# Altium schematic sheet Measure.SchDoc
size A3; SheetNumber: 4; SheetTotal: 5
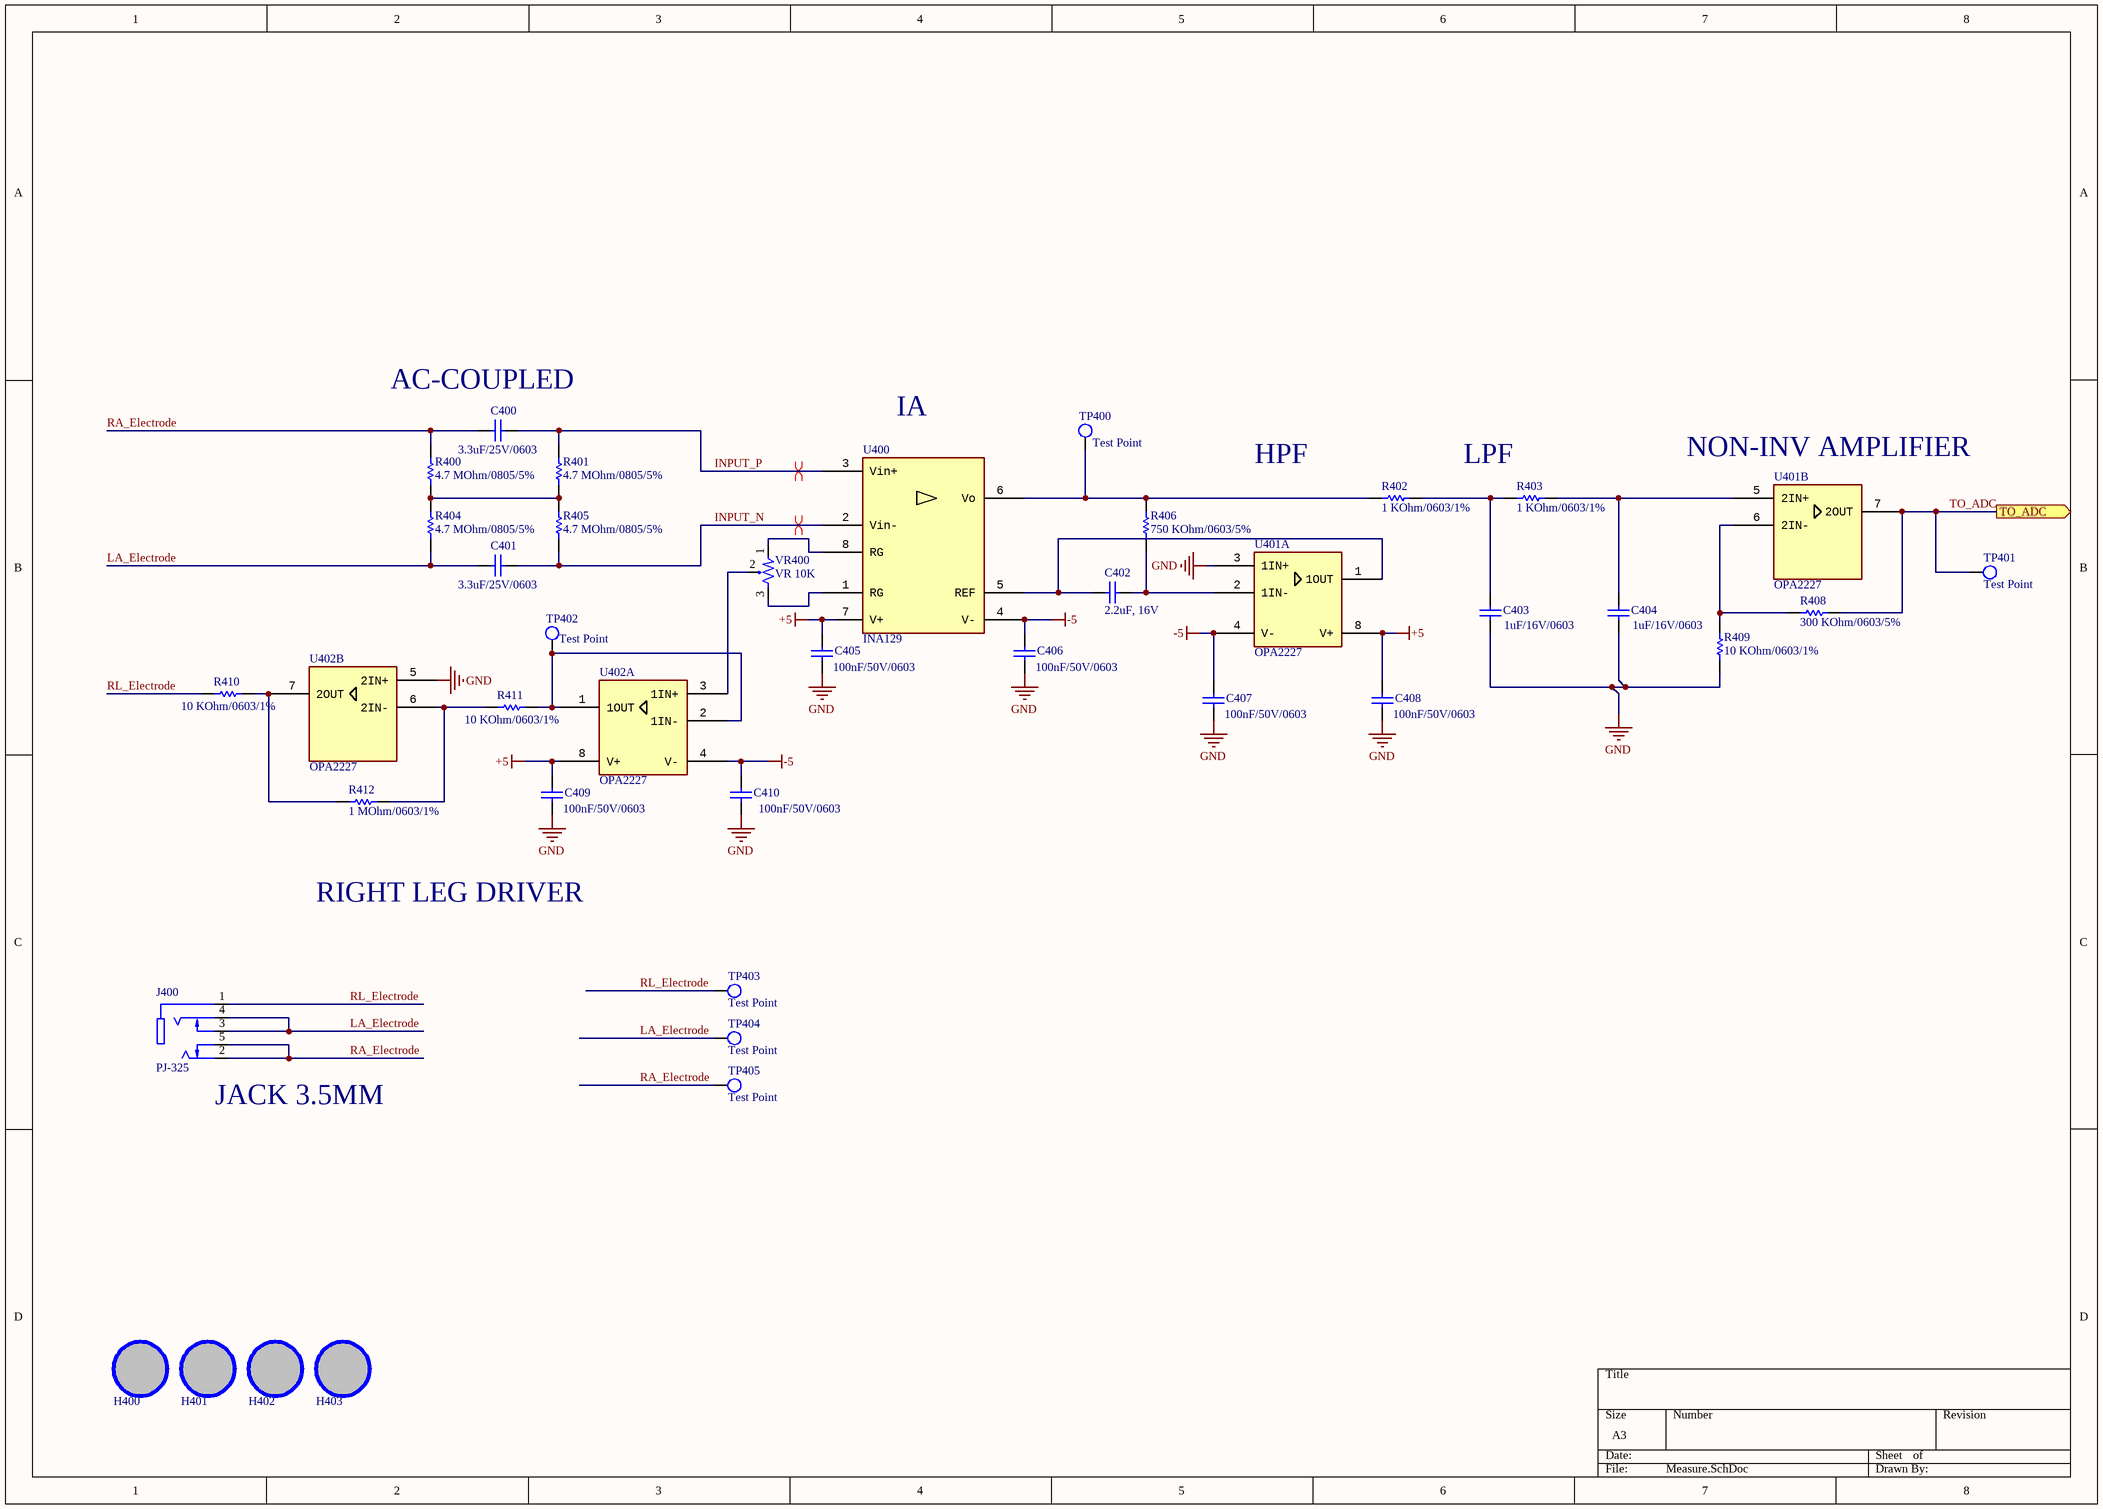
[diagram p0: Measure.SchDoc]

## Parts
C400  value 3.3uF/25V/0603  [WCAP-CSGP_0805_H=1.25mm]  (hidden comment: 3.3uF, 25V)
C401  value 3.3uF/25V/0603  [WCAP-CSGP_0805_H=1.25mm]  (hidden comment: 3.3uF, 25V)
C402  2.2uF, 16V  [WCAP-CSGP_0603_H=0.8mm_Reflow]
C403  value 1uF/16V/0603  [WCAP-CSGP_0603_H=0.8mm_Reflow]  (hidden comment: 1uF, 16V)
C404  value 1uF/16V/0603  [WCAP-CSGP_0603_H=0.8mm_Reflow]  (hidden comment: 1uF, 16V)
C405  value 100nF/50V/0603  [WCAP-CSGP_0603_H=0.8mm_Reflow]  (hidden comment: 100nF, 25V)
C406  value 100nF/50V/0603  [WCAP-CSGP_0603_H=0.8mm_Reflow]  (hidden comment: 100nF, 25V)
C407  value 100nF/50V/0603  [WCAP-CSGP_0603_H=0.8mm_Reflow]  (hidden comment: 100nF, 25V)
C408  value 100nF/50V/0603  [WCAP-CSGP_0603_H=0.8mm_Reflow]  (hidden comment: 100nF, 25V)
C409  value 100nF/50V/0603  [WCAP-CSGP_0603_H=0.8mm_Reflow]  (hidden comment: 100nF, 25V)
C410  value 100nF/50V/0603  [WCAP-CSGP_0603_H=0.8mm_Reflow]  (hidden comment: 100nF, 25V)
H400  Hole  [LO KHOAN 3MM]  (value not drawn)
H401  Hole  [LO KHOAN 3MM]  (value not drawn)
H402  Hole  [LO KHOAN 3MM]  (value not drawn)
H403  Hole  [LO KHOAN 3MM]  (value not drawn)
J400  value PJ-325  [3.5 mm, Strereo]  (hidden comment: PJ-324)
R400  value 4.7 MOhm/0805/5%  [R0805]  (hidden comment: Resistor 4.7 MOhm 0805 5%)
R401  value 4.7 MOhm/0805/5%  [R0805]  (hidden comment: Resistor 4.7 MOhm 0805 5%)
R402  value 1 KOhm/0603/1%  [R0603]  (hidden comment: Resistor 1 KOhm 0603 1%)
R403  value 1 KOhm/0603/1%  [R0603]  (hidden comment: Resistor 1 KOhm 0603 1%)
R404  value 4.7 MOhm/0805/5%  [R0805]  (hidden comment: Resistor 4.7 MOhm 0805 5%)
R405  value 4.7 MOhm/0805/5%  [R0805]  (hidden comment: Resistor 4.7 MOhm 0805 5%)
R406  value 750 KOhm/0603/5%  [R0603]  (hidden comment: Resistor 750 KOhm 0603 5%)
R408  value 300 KOhm/0603/5%  [R0603]  (hidden comment: Resistor 300 KOhm 0603 5%)
R409  value 10 KOhm/0603/1%  [R0603]  (hidden comment: Resistor 10 KOhm 0603 1%)
R410  value 10 KOhm/0603/1%  [R0603]  (hidden comment: Resistor 10 KOhm 0603 1%)
R411  value 10 KOhm/0603/1%  [R0603]  (hidden comment: Resistor 10 KOhm 0603 1%)
R412  value 1 MOhm/0603/1%  [R0603]  (hidden comment: Resistor 1 MOhm 0603 1%)
TP400  Test Point  [TP]
TP401  Test Point  [TP]
TP402  Test Point  [TP]
TP403  Test Point  [TP]
TP404  Test Point  [TP]
TP405  Test Point  [TP]
U400  INA129  [SOIC-8]
U401  OPA2227  [SOIC-8]  (parts A,B of 2)
U402  OPA2227  [SOIC-8]  (parts A,B of 2)
VR400  value VR 10K  [VARISTOR 2]  (hidden comment: 10K)

## Ports
TO_ADC (out)

## Nets
+5: C405.2 C408.1 C409.2 U400.7(V+) U401.8(V+) U402.8(V+)
-5: C406.1 C407.2 C410.1 U400.4(V-) U401.4(V-) U402.4(V-)
GND: C403.1 C404.1 C405.1 C406.2 C407.1 C408.2 C409.1 C410.2 R409.1 U401.3(1IN+) U402.5(2IN+)
INPUT_N: C401.2 R405.1 U400.2(Vin-)
INPUT_P: C400.2 R401.2 U400.3(Vin+)
LA_Electrode: C401.1 J400.3 J400.4 R404.1 TP404.TP1
RA_Electrode: C400.1 J400.2 J400.5 R400.2 TP405.TP1
RL_Electrode: J400.1 R410.1 TP403.TP1
TO_ADC: R408.2 TP401.TP1 U401.7(2OUT) ; port TO_ADC
NetC402_1: C402.1 R406.1 U401.2(1IN-)
NetC402_2: C402.2 U400.5(REF) U401.1(1OUT)
NetC403_2: C403.2 R402.2 R403.1
NetC404_2: C404.2 R403.2 U401.5(2IN+)
NetR400_1: R400.1 R401.1 R404.2 R405.2
NetR402_1: R402.1 R406.2 TP400.TP1 U400.6(Vo)
NetR408_1: R408.1 R409.2 U401.6(2IN-)
NetR410_2: R410.2 R412.1 U402.7(2OUT)
NetR411_1: R411.1 R412.2 U402.6(2IN-)
NetR411_2: R411.2 TP402.TP1 U402.1(1OUT) U402.2(1IN-)
NetU400_1: U400.1(RG) VR400.3
NetU400_8: U400.8(RG) VR400.1
NetU402_3: U402.3(1IN+) VR400.2

Not connected (* = marked no-connect by the designer): H400 1; H401 1; H402 1; H403 1

## Layout directives
differential pair: INPUT_N, INPUT_P

## Notes on the sheet
- (near C400) AC-COUPLED
- (near U400) IA
- HPF
- (near R403) LPF
- (near U401) NON-INV AMPLIFIER
- RIGHT LEG DRIVER
- (near J400) JACK 3.5MM

## Library data of the parts
C400 C401 = 885012107017: WCAP-CSGP Multilayer Ceramic Chip Capacitor, General Purpose, size 0805, X5R, 3.3uF, 25V; Manufacturer: Wurth Elektronik; Rated Voltage: 25VDC; Isolation Resistance: >=0.03GOhm; Capacitance Tolerance: +/-20%; Technical Reference: X5R0805335M025DFCT10000; ComponentLink1Description: Manufacturer; ComponentLink1URL: http://www.we-online.de; ComponentLink2Description: Datasheet; ComponentLink2URL: https://www.we-online.com/catalog/datasheet/885012107017.pdf; Operating Temperature: -55 to +85degC; Packaging: Tape and Reel; Manufacturer Part Number: 885012107017; Published Date: May 2020; Ceramic Type: X5R; Dissipation Factor: =<10%; Height: 1.25mm; Mounting Technology: SMT; Size: 0805
C402 = 885012106018: WCAP-CSGP Multilayer Ceramic Chip Capacitor, General Purpose, size 0603, X5R, 2.2uF, 16V; Manufacturer: Wurth Elektronik; Rated Voltage: 16VDC; Isolation Resistance: >=0.05GOhm; Capacitance Tolerance: +/-20%; Technical Reference: X5R0603225M016DFCT10000; ComponentLink1Description: Manufacturer; ComponentLink1URL: http://www.we-online.de; ComponentLink2Description: Datasheet; ComponentLink2URL: https://www.we-online.com/catalog/datasheet/885012106018.pdf; Operating Temperature: -55 to +85degC; Packaging: Tape and Reel; Manufacturer Part Number: 885012106018; Published Date: May 2020; Ceramic Type: X5R; Dissipation Factor: =<10%; Height: 0.8mm; Mounting Technology: SMT; Size: 0603; Capacitance: 2.2uF
C403 C404 = 885012106017: WCAP-CSGP Multilayer Ceramic Chip Capacitor, General Purpose, size 0603, X5R, 1uF, 16V; Manufacturer: Wurth Elektronik; Rated Voltage: 16VDC; Isolation Resistance: >=0.1GOhm; Capacitance Tolerance: +/-20%; Technical Reference: X5R0603105M016DFCT10000; ComponentLink1Description: Manufacturer; ComponentLink1URL: http://www.we-online.de; ComponentLink2Description: Datasheet; ComponentLink2URL: https://www.we-online.com/catalog/datasheet/885012106017.pdf; Operating Temperature: -55 to +85degC; Packaging: Tape and Reel; Manufacturer Part Number: 885012106017; Published Date: May 2020; Ceramic Type: X5R; Dissipation Factor: =<10%; Height: 0.8mm; Mounting Technology: SMT; Size: 0603
C405-C410 = 885012206071: WCAP-CSGP Multilayer Ceramic Chip Capacitor, General Purpose, size 0603, X7R, 100nF, 25V; Manufacturer: Wurth Elektronik; Rated Voltage: 25VDC; Isolation Resistance: >=5GOhm; Capacitance Tolerance: +/-10%; Technical Reference: X7R0603104K025DFCT10000; ComponentLink1Description: Manufacturer; ComponentLink1URL: http://www.we-online.de; ComponentLink2Description: Datasheet; ComponentLink2URL: https://www.we-online.com/catalog/datasheet/885012206071.pdf; Operating Temperature: -55 to +125degC; Packaging: Tape and Reel; Manufacturer Part Number: 885012206071; Published Date: May 2020; Ceramic Type: X7R; Dissipation Factor: =<3.5%; Height: 0.8mm; Mounting Technology: SMT; Size: 0603
H400-H403 = Hole: Hole 3mm
J400 = PJ-324: Jack 3.5 3-Pole 5-Pin; ComponentLink1Description: Buy; ComponentLink1URL: https://www.thegioiic.com/pj-324-cong-audio-3-5mm-3-cuc-5-chan-han-pcb
R400 R401 R404 R405 = Resistor 4.7 MOhm 0805 5%: Code 475, 1/8W; ComponentLink1Description: Buy; ComponentLink1URL: https://www.thegioiic.com/dien-tro-4-7-mohm-0805-5-
R402 R403 = Resistor 1 KOhm 0603 1%: Code 102, 1/10W; ComponentLink1Description: Buy; ComponentLink1URL: https://www.thegioiic.com/dien-tro-1-kohm-0603-1
R406 = Resistor 750 KOhm 0603 5%: Code 754, 1/10W
R408 = Resistor 300 KOhm 0603 5%: Code 304, 1/10W
R409-R411 = Resistor 10 KOhm 0603 1%: Code 103, 1/10W; ComponentLink1Description: Buy; ComponentLink1URL: https://www.thegioiic.com/dien-tro-10-kohm-0603-1-
R412 = Resistor 1 MOhm 0603 1%: Code 105, 1/10W; ComponentLink1Description: Buy; ComponentLink1URL: https://www.thegioiic.com/dien-tro-1-mohm-0603-1-
U400 = INA129: Precision, Low Power Instrumentation Amplifiers; ComponentLink1Description: Buy; ComponentLink1URL: *; ComponentLink2Description: Datasheet; ComponentLink2URL: https://www.ti.com/lit/ds/symlink/ina129-ep.pdf?ts=1697381225295&ref_url=https%253A%252F%252Fwww.google.com%252F; Value: INA129
U401 U402 = OPA2227: High-Precision, Low-Noise Operational Amplifiers; ComponentLink1Description: Datasheet; ComponentLink1URL: https://www.ti.com/lit/ds/symlink/opa2227.pdf?ts=1697381749451&ref_url=https%253A%252F%252Fwww.ti.com%252Fproduct%252FOPA2227; Value: OPA2227
VR400 = Var Resistor